# EAGLE design pcb-breakout-bgm111 (EAGLE 7.4.0)
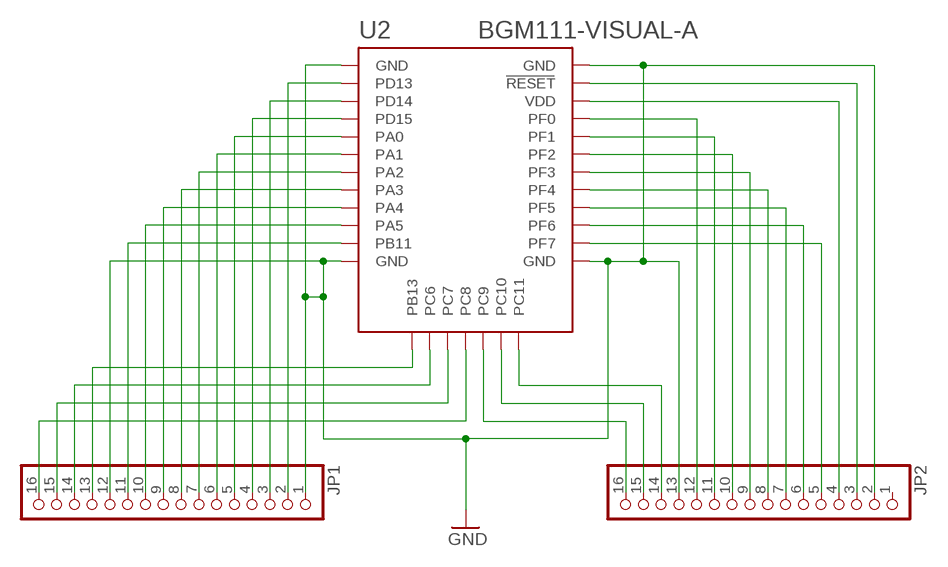
[diagram p0: schematic, sheet 1]

## Parts
JP1  PINHD-1X16  [1X16]
JP2  PINHD-1X16  [1X16]
U2  BGM111-VISUAL-A  [BGM111-A]

## Nets
GND: JP1.1 JP1.12 JP2.2 JP2.13 U2.GND U2.GND@2(GND) U2.GND@3(GND) U2.GND@4(GND)
N$2: JP1.2 U2.PD13
N$3: JP1.3 U2.PD14
N$4: JP1.4 U2.PD15
N$5: JP1.5 U2.PA0
N$6: JP1.6 U2.PA1
N$7: JP1.7 U2.PA2
N$8: JP1.8 U2.PA3
N$9: JP1.9 U2.PA4
N$10: JP1.10 U2.PA5
N$11: JP1.11 U2.PB11
N$13: JP1.13 U2.PB13
N$14: JP1.14 U2.PC6
N$15: JP1.15 U2.PC7
N$16: JP1.16 U2.PC8
N$17: JP2.16 U2.PC9
N$18: JP2.15 U2.PC10
N$19: JP2.14 U2.PC11
N$22: JP2.3 U2.RESET
N$23: JP2.4 U2.VDD
N$24: JP2.5 U2.PF7
N$25: JP2.6 U2.PF6
N$26: JP2.7 U2.PF5
N$27: JP2.8 U2.PF4
N$28: JP2.9 U2.PF3
N$29: JP2.10 U2.PF2
N$30: JP2.11 U2.PF1
N$31: JP2.12 U2.PF0
Unconnected: JP2.1

## Library data of the parts
JP1 JP2 = pinhead:PINHD-1X16: PIN HEADER
U2 = sf-bluegiga:BGM111-VISUAL: Bluetooth 4.1 (4.2 ready) low-energy module (Bluetooth Smart) - BGM111-A variant has an on-module ceramic chip antenna. BGM111-A variant includes keepout/restrict area. Antenna edge of the module should be flush up against the edge of the PCB. See datasheet for variant layout details. IT IS EXTREMELY IMPORTANT THAT YOU FOLLOW THE LAYOUT GUIDELINES FOR THIS MODULE IN ORDER TO ENSURE MAXIMUM RANGE. THIS MEANS THAT YOU NEED A SOLID GROUND PLANE EXTENDING IDEALLY 17 mm ON THE LEFT AND RIGHT SIDES OF THE MODULE, AS SHOWN IN THE DATASHEET. The Silicon Labs Blue Gecko BGM111 Bluetooth® Smart module integrates our next generation wireless SoC with a complete Bluetooth Smart software stack and antenna to provide a complete, pre-certified plug-and-play Bluetooth Smart solution. It solves one of the major customer roadblocks for fast time-to-market as it integrates antenna, software and RF certifications, saving months of engineering effort and testing. https://www.silabs.com/products/wireless/bluetooth/Pages/BGM111-bluetooth-smart-module.aspx https://github.com/jrowberg/sf-oshw Last updated 2015-09-02 by Jeff Rowberg <jeff@rowberg.net>; ANTENNA: On-module ceramic chip antenna

## Board
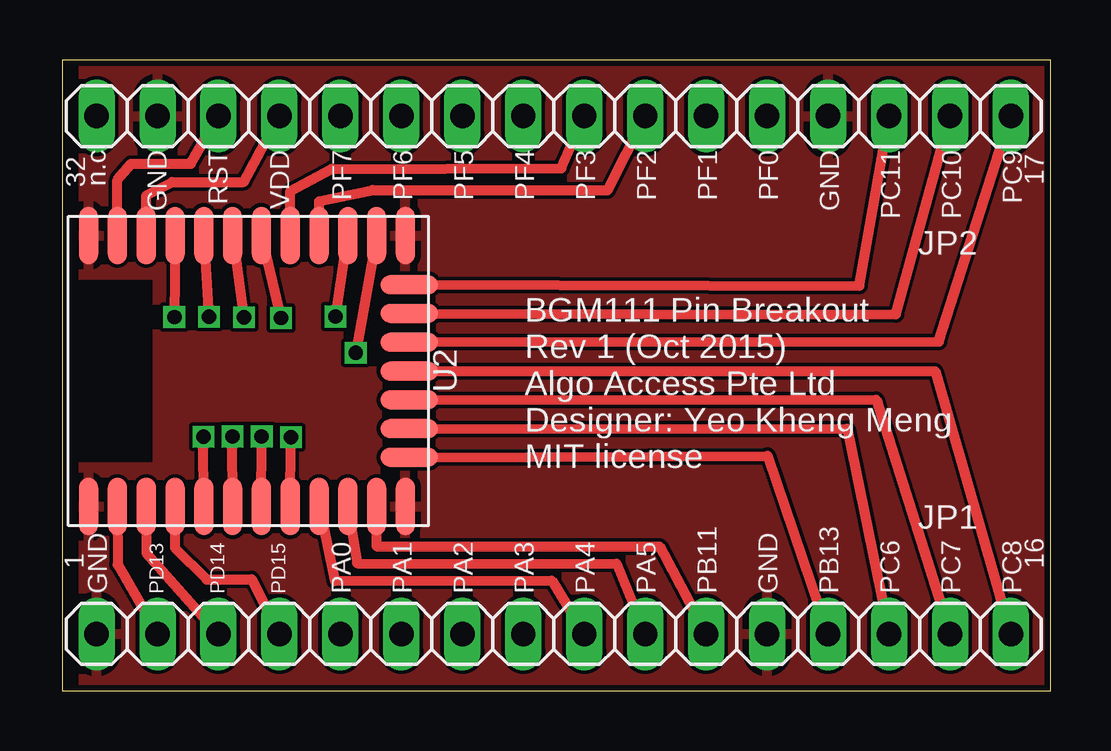
[diagram p1: board, top side]
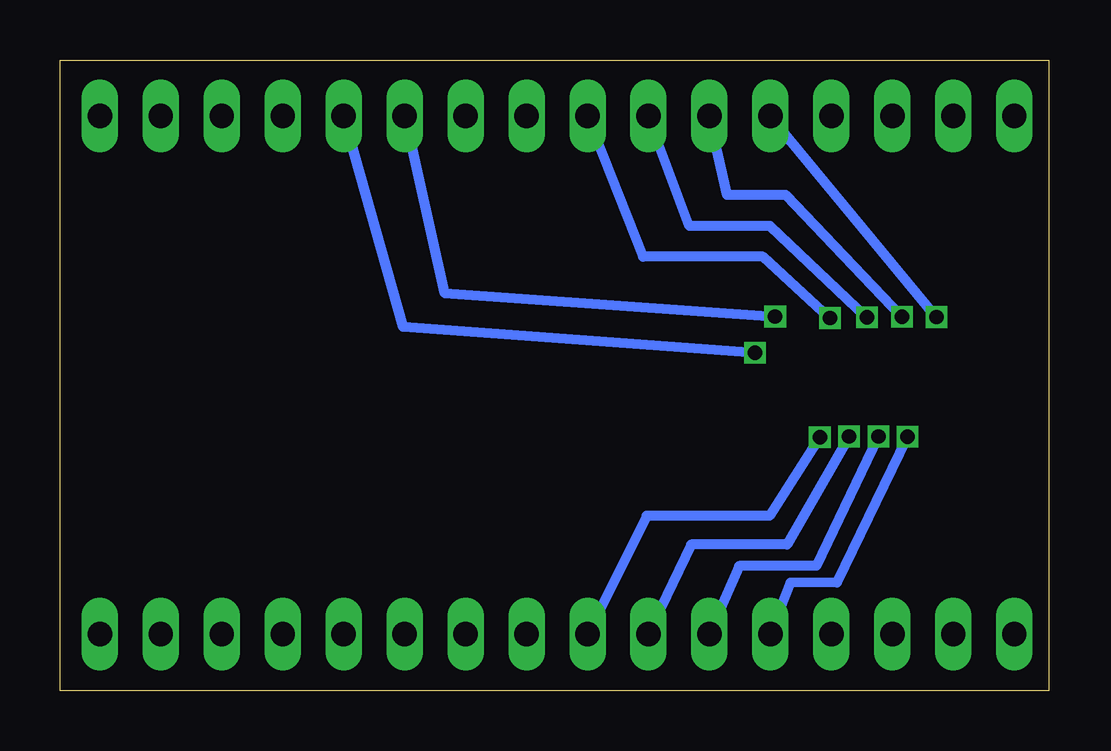
[diagram p2: board, bottom side, seen from below]

Size 41.2 x 26.3 mm. Coordinates in mm from the lower left corner, seen from the top.
Outline: 0,0 41.2,0 41.2,26.3 0,26.3 0,0
Copper layers (1*16): Top 0.035mm / dielectric 1.5mm / Bottom 0.035mm
Design rules "Elecrow_2-layer_eagle_rule": minimum track width 6mil, minimum drill 12mil, track to track 6mil, track to pad 6mil, pad to pad 6mil, via to via 6mil, smd to smd 0mil, copper to edge 10mil, drill to drill 10mil, minimum pad ring 10mil, minimum via ring 6mil, stop-mask expansion 2mil, vias tented up to drill 100mil, thermal gap 10mil

### Footprints (pad centres in the part's own frame; a part is rotated, then mirrored left to right if it is on the bottom)
1X16 = drill 1.016 long: 1 -19.05,0; 2 -16.51,0; 3 -13.97,0; 4 -11.43,0; 5 -8.89,0; 6 -6.35,0; 7 -3.81,0; 8 -1.27,0; 9 1.27,0; 10 3.81,0; 11 6.35,0; 12 8.89,0; 13 11.43,0; 14 13.97,0; 15 16.51,0; 16 19.05,0
BGM111-A = smd 2.4 x 0.8: GND -5.65,6.65; GND@2 -5.65,-6.55; GND@3 5.65,-6.55; GND@4 5.65,6.65; PA0 -5.65,1.85; PA1 -5.65,0.65; PA2 -5.65,-0.55; PA3 -5.65,-1.75; PA4 -5.65,-2.95; PA5 -5.65,-4.15; PB11 -5.65,-5.35; PD13 -5.65,5.45; PD14 -5.65,4.25; PD15 -5.65,3.05; PF0 5.65,-5.35; PF1 5.65,-4.15; PF2 5.65,-2.95; PF3 5.65,-1.75; PF4 5.65,-0.55; PF5 5.65,0.65; PF6 5.65,1.85; PF7 5.65,3.05; RESET 5.65,5.45; VDD 5.65,4.25 | smd 0.8 x 2.4: PB13 -3.6,-6.7; PC6 -2.4,-6.7; PC7 -1.2,-6.7; PC8 0,-6.7; PC9 1.2,-6.7; PC10 2.4,-6.7; PC11 3.6,-6.7

### Placement (x,y rotation side)
JP1  20.49,2.37 0 top
JP2  20.49,23.96 0 top
U2  7.76,13.33 90 top

### Tracks (layer width: path | path; a pad name or v marks a point on that pad's centre or on a via)
GND
  pour Top: 0.9,26.3 40.9,26.3 40.9,-0.2 0.9,-0.2
N$2
  Top 0.406: U2.PD13 2.32,5.26 JP1.2
N$3
  Top 0.406: U2.PD14 3.52,5.74 JP1.3
N$4
  Top 0.406: U2.PD15 4.7,5.96 6.03,4.64 7.9,4.65 JP1.4
N$5  (via drill 0.6)
  Top 0.406: U2.PA0 v5.89,10.59
  Bottom 0.406: v5.89,10.59 8.83,4.51 10.77,4.5 JP1.5
N$6  (via drill 0.6)
  Top 0.406: U2.PA1 v7.1,10.6
  Bottom 0.406: v7.1,10.6 9.68,5.21 12.9,5.2 JP1.6
N$7  (via drill 0.6)
  Top 0.406: U2.PA2 v8.32,10.6
  Bottom 0.406: v8.32,10.6 10.9,6.1 14.9,6.1 JP1.7
N$8  (via drill 0.6)
  Top 0.406: U2.PA3 v9.54,10.57
  Bottom 0.406: v9.54,10.57 11.63,7.29 16.76,7.3 JP1.8
N$9
  Top 0.406: U2.PA4 11.37,4.58 20.4,4.6 JP1.9
N$10
  Top 0.406: U2.PA5 12.3,5.32 23.11,5.3 JP1.10
N$11
  Top 0.406: U2.PB11 13.1,6.02 24.9,6.01 JP1.11
N$13
  Top 0.406: U2.PB13 29.4,9.8 JP1.13
N$14
  Top 0.406: U2.PC6 32.71,10.92 JP1.14
N$15
  Top 0.406: U2.PC7 33.92,12.14 JP1.15
N$16
  Top 0.406: U2.PC8 36.38,13.33 JP1.16
N$17
  Top 0.406: U2.PC9 36.54,14.56 JP2.16
N$18
  Top 0.406: U2.PC10 34.74,15.69 JP2.15
N$19
  Top 0.406: U2.PC11 33.22,16.88 JP2.14
N$22
  Top 0.406: U2.RESET 2.31,21.31 2.88,21.97 5.37,21.97 JP2.3
N$23
  Top 0.406: U2.VDD 3.51,20.66 4.59,21.21 7.58,21.21 JP2.4
N$24  (via drill 0.6)
  Top 0.406: U2.PF7 v4.68,15.58
  Bottom 0.406: v4.68,15.58 JP2.5
N$25  (via drill 0.6)
  Top 0.406: U2.PF6 v6.12,15.59
  Bottom 0.406: v6.12,15.59 10.97,20.67 13.4,20.67 JP2.6
N$26  (via drill 0.6)
  Top 0.406: U2.PF5 v7.58,15.57
  Bottom 0.406: v7.58,15.57 11.61,19.38 14.98,19.38 JP2.7
N$27  (via drill 0.6)
  Top 0.406: U2.PF4 v9.12,15.54
  Bottom 0.406: v9.12,15.54 11.9,18.1 16.9,18.1 JP2.8
N$28
  Top 0.406: U2.PF3 9.51,20.84 11.22,21.75 20.81,21.78 JP2.9
N$29
  Top 0.406: U2.PF2 10.71,20.41 12.94,20.88 22.73,20.87 JP2.10
N$30  (via drill 0.6)
  Top 0.406: v11.4,15.6 U2.PF1
  Bottom 0.406: JP2.11 25.18,16.59 v11.4,15.6
N$31  (via drill 0.6)
  Top 0.406: U2.PF0 v12.24,14.09
  Bottom 0.406: v12.24,14.09 26.9,15.17 JP2.12

### Text on the board
tPlace: n.c | GND | RST | VDD | PF7 | PF6 | PF5 | PF4 | PF3 | PF2 | PF1 | PF0 | GND | PC11 | PC10 | PC9 | 32 | 17 | BGM111 Pin Breakout / Rev 1 (Oct 2015) / Algo Access Pte Ltd / Designer: Yeo Kheng Meng / MIT license | 1 | 16 | GND | PD13 | PD14 | PD15 | PA0 | PA1 | PA2 | PA3 | PA4 | PA5 | PB11 | GND | PB13 | PC6 | PC7 | PC8